# Altium schematic sheet Information.SchDoc
size A; SheetNumber: 1; SheetTotal: 4
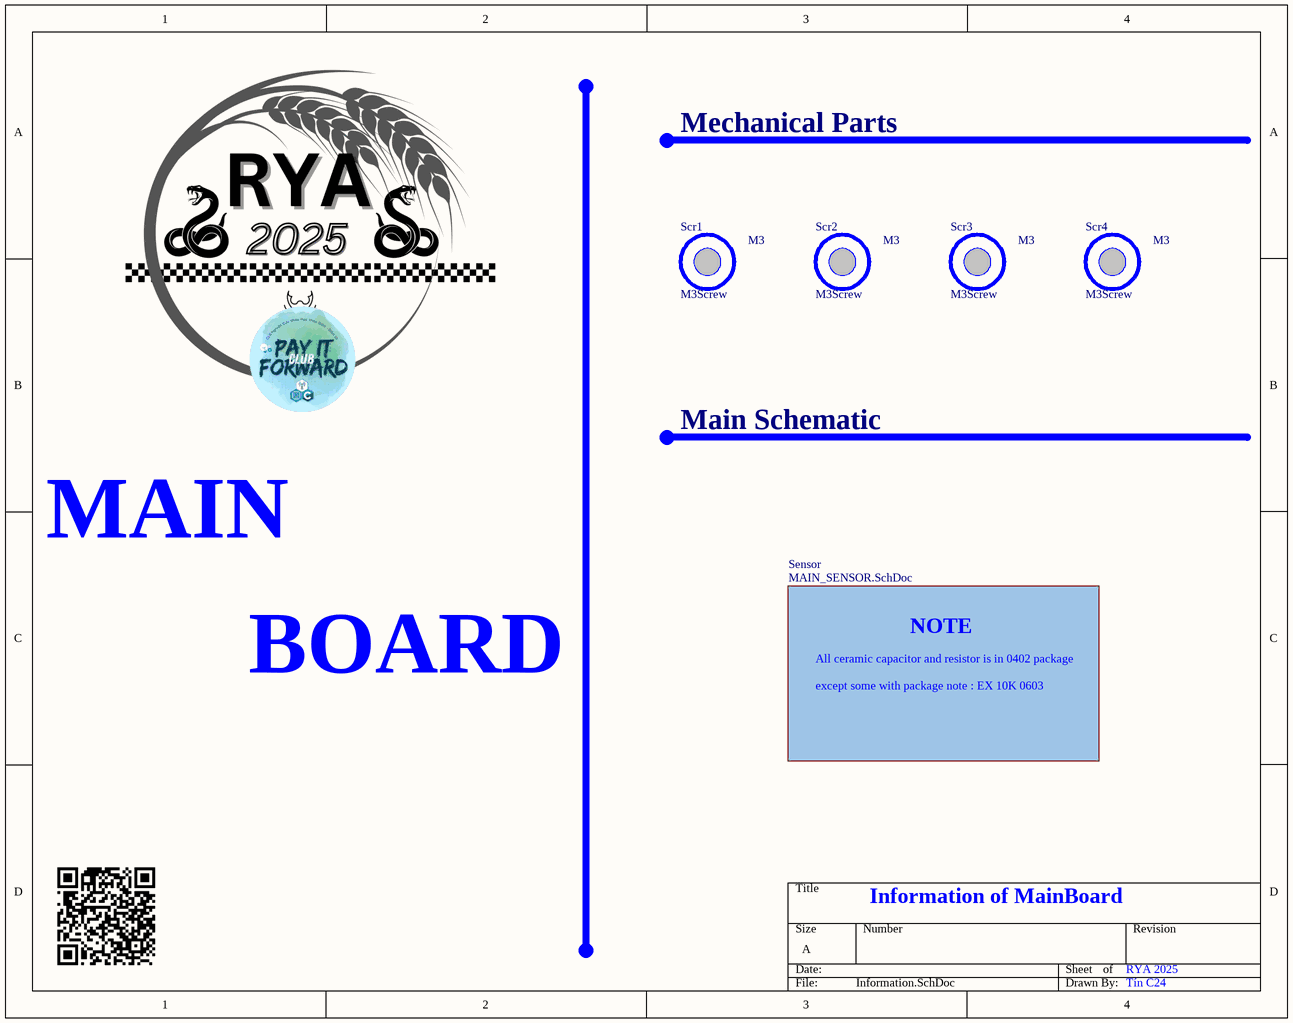
[diagram p0: Information.SchDoc]

## Parts
Scr1  M3Screw  [M3Screw]
Scr2  M3Screw  [M3Screw]
Scr3  M3Screw  [M3Screw]
Scr4  M3Screw  [M3Screw]

## Sub-sheets
Sensor = MAIN_SENSOR.SchDoc: no entries

## Notes on the sheet
- Mechanical Parts
- Main Schematic
- MAIN
- NOTE
- BOARD
- All ceramic capacitor and resistor is in 0402 package
- except some with package note : EX 10K 0603
- Information of MainBoard
- RYA 2025
- Tín C24
- (in symbol M3Screw) M3